# EasyEDA Pro project Git_USB_Hub.epro

# Schematic Schematic1
Board Name: Board1; Create Date: 2026-07-28; Page Name: P1; Project Name: USB_Hub; Schematic Name: Schematic1; Update Date: 2026-07-28; Company: EasyEDA.com; Page Size: A4; Version: V1.0
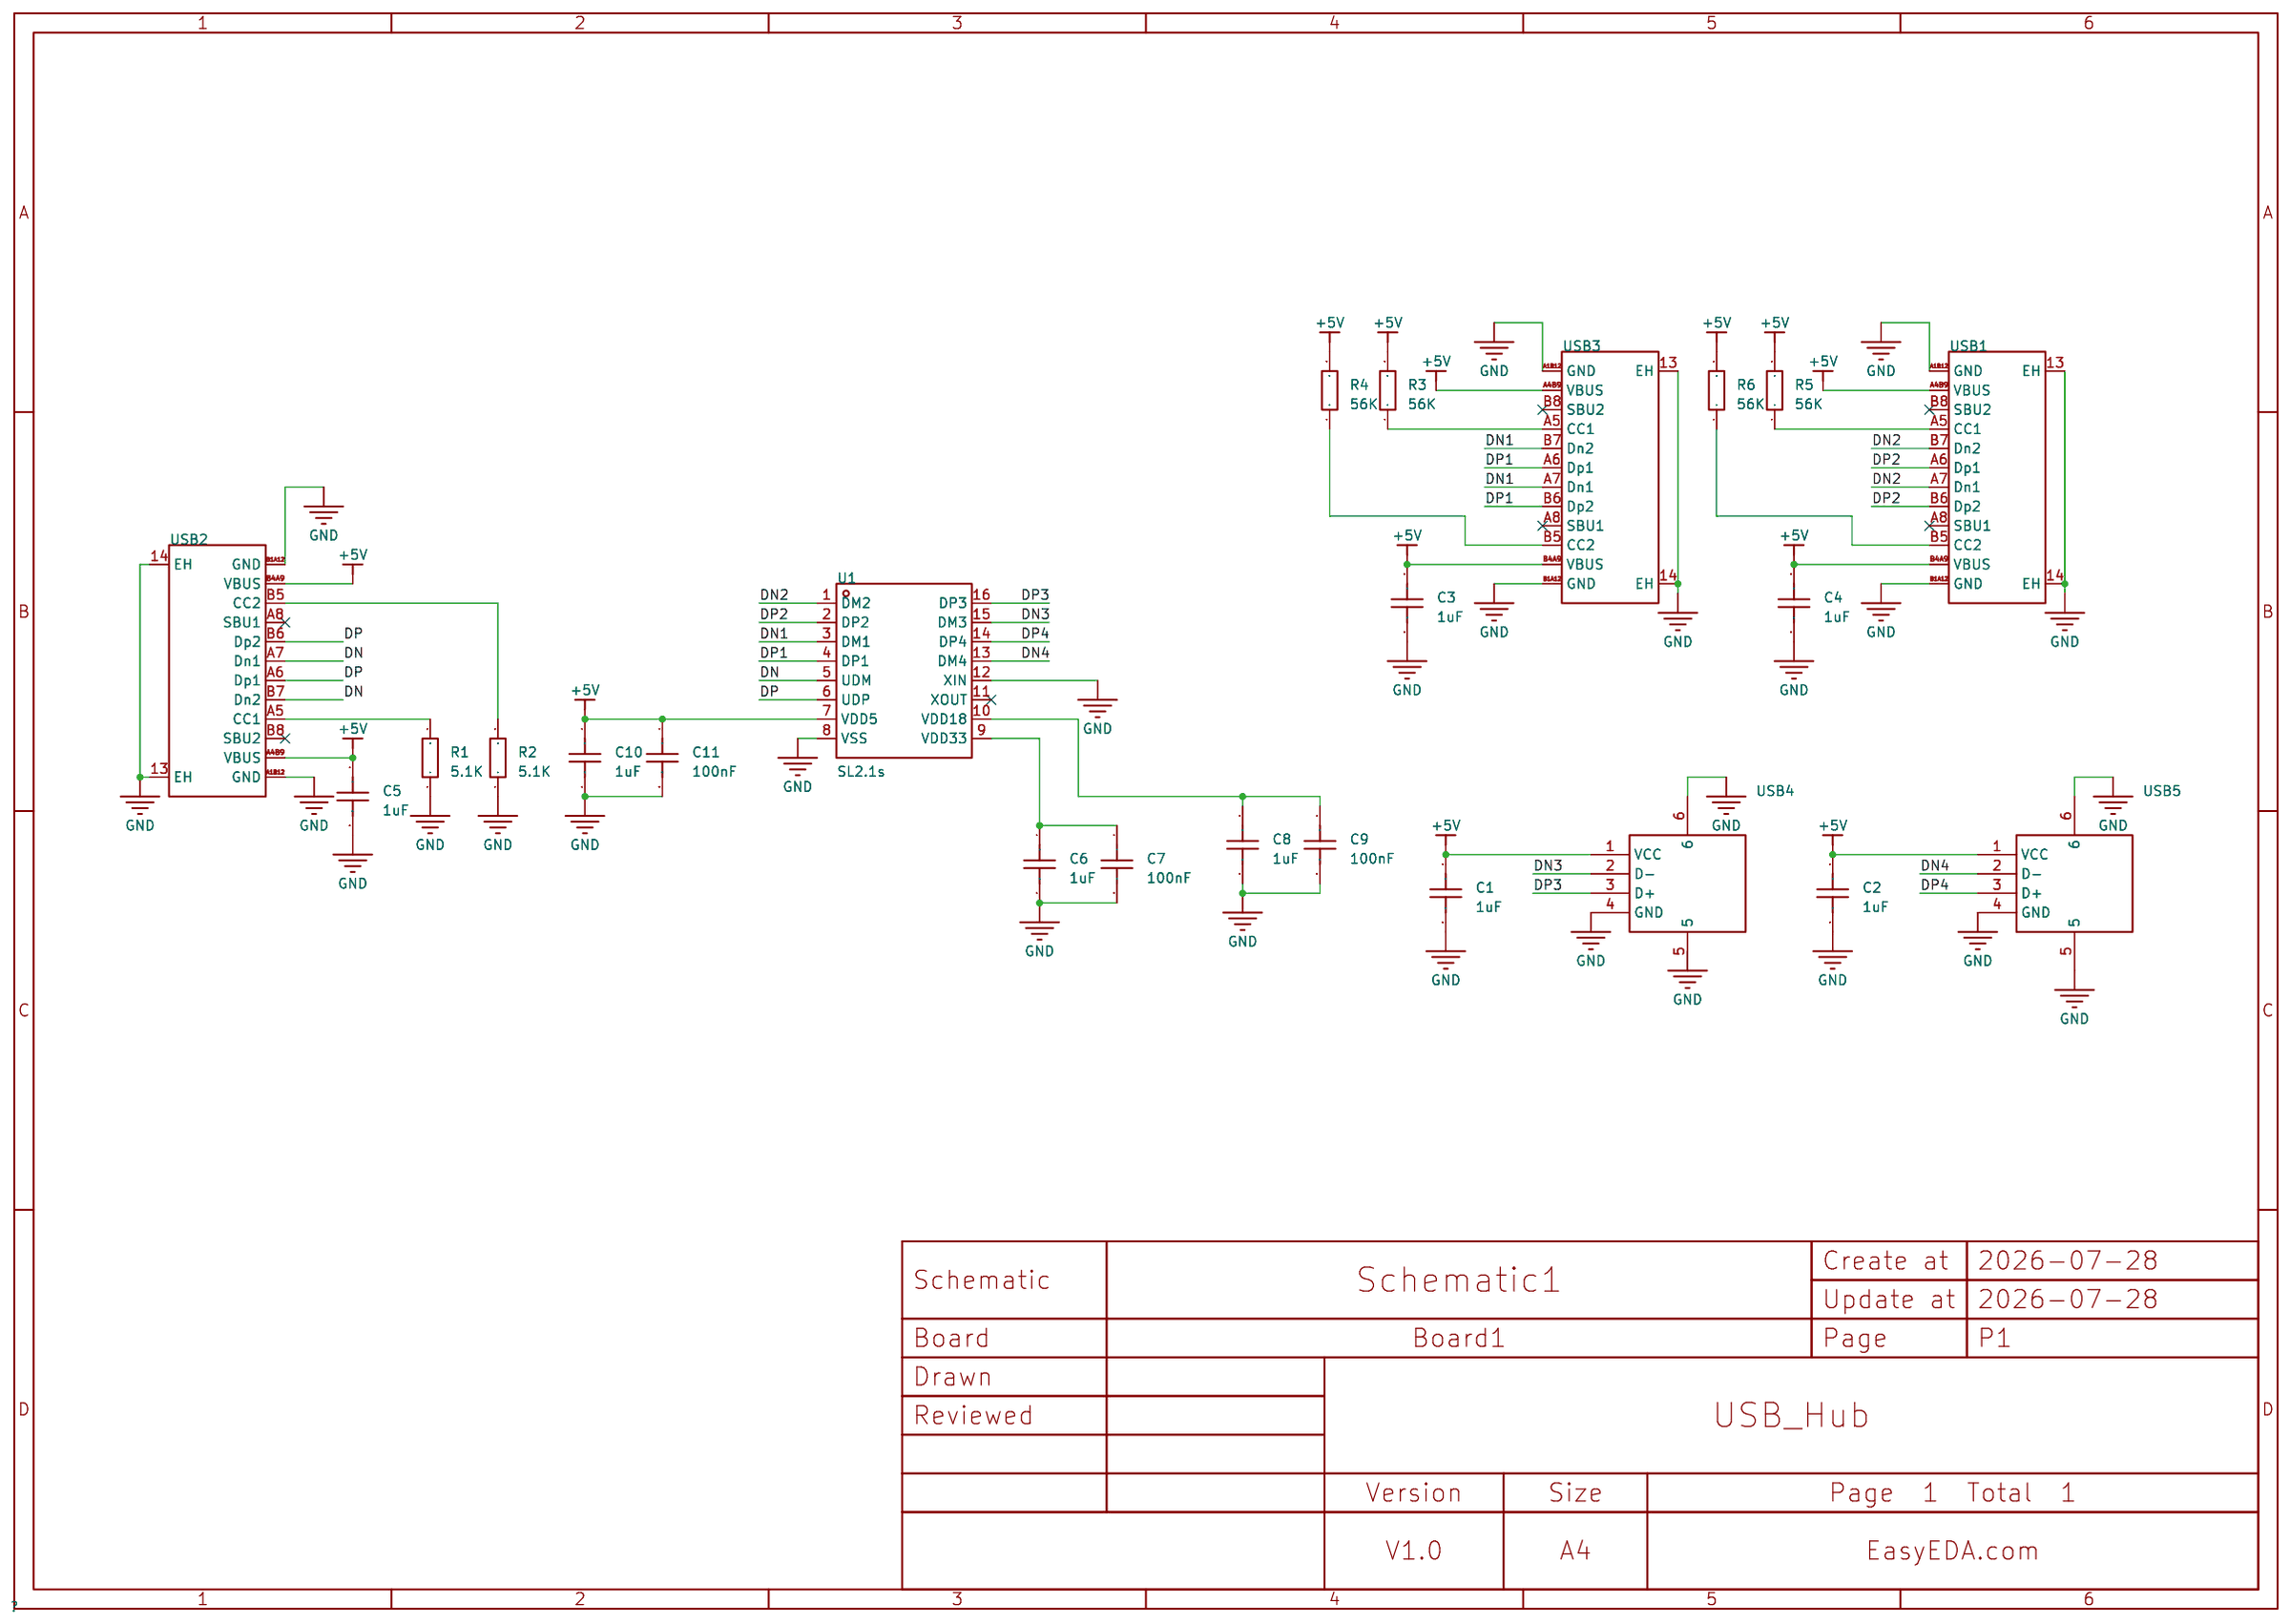
[diagram p0: schematic sheet]

## Parts
C1  1uF  [C0603]
C2  1uF  [C0603]
C3  1uF  [C0603]
C4  1uF  [C0603]
C5  1uF  [C0603]
C6  1uF  [C0603]
C7  100nF  [C0603]
C8  1uF  [C0603]
C9  100nF  [C0603]
C10  1uF  [C0603]
C11  100nF  [C0603]
R1  5.1K  [R0603]
R2  5.1K  [R0603]
R3  56K  [R0603]
R4  56K  [R0603]
R5  56K  [R0603]
R6  56K  [R0603]
U1  SL2.1s  [SSOP-16_L4.6-W2.6-P0.53-LS4.0-BL]
USB1  TYPE-C 16PIN 2MD(073)  [USB-C-SMD_TYPE-C-16PIN-2MD-073]
USB2  TYPE-C 16PIN 2MD(073)  [USB-C-SMD_TYPE-C-16PIN-2MD-073]
USB3  TYPE-C 16PIN 2MD(073)  [USB-C-SMD_TYPE-C-16PIN-2MD-073]
USB4  10.0 QHHTZB6.3  [USB-A-TH_10.0QHHTZB6.3]
USB5  10.0 QHHTZB6.3  [USB-A-TH_10.0QHHTZB6.3]

## Library data of the parts
C1-C11 = CAP_0603: Supplier Footprint: 0603
R1-R6 = Res_0603: Supplier Footprint: 0603
U1 = SL2.1s: type:Hub USB Protocol:USB 2.0 Data Rate:- Voltage - Supply:4V~5.25V Voltage - Supply:4V~5.25V Operating Temperature:0℃~+70℃ Operating Temperature:0℃~+70℃ Memory Interface:- Current - Supply:120mA Quiescent Supply Current:2.5mA Number of Channels:4; LCSC Part Name: USB2.0 HUB控制器集成电路; Supplier Part: C2684433; Manufacturer: CoreChips(和芯润德); Supplier Footprint: SSOP-16; JLCPCB Part Class: Extended Part; Datasheet: https://item.szlcsc.com/datasheet/SL2.1s/2782346.html; Supplier: LCSC; type: Hub; USB Protocol: USB 2.0; Voltage - Supply: 4V~5.25V; Operating Temperature: 0℃~+70℃; Current - Supply: 120mA; Quiescent Supply Current: 2.5mA; Number of Channels: 4
USB1-USB3 = TYPE-C 16PIN 2MD(073): Connector Type:Type-C Protocol Standard:- Gender:Female Mounting Type:Surface Mount, Right Angle Number of Contacts:16P Number of Ports:1 Current Rating-Power:3A Voltage Rating:5V Connect-Disconnect Life:10,000 cycles Supplementary Features:- Center Heigh; LCSC Part Name: Type-C 母 卧贴; Supplier Part: C2765186; Manufacturer: SHOU HAN(首韩); Supplier Footprint: SMD; JLCPCB Part Class: Extended Part; Datasheet: https://item.szlcsc.com/datasheet/TYPE-C%252016PIN%25202MD(073)/2901843.html; Supplier: LCSC; Connector Type: Type-C; Gender: Female; Mounting Type: Surface Mount, Right Angle; Number of Contacts: 16P; Number of Ports: 1; Current Rating-Power: 3A; Voltage Rating: 5V; Connect-Disconnect Life: 10,000 cycles; Detection color: Black; Operating Temperature: -25℃~+85℃
USB4 USB5 = 10.0 QHHTZB6.3: Connector Type:Type-A Protocol Standard:USB 2.0 Gender:Female Mounting Type:Surface Mount, Right Angle Number of Contacts:4P Number of Ports:1 Current Rating-Power:1.5A Voltage Rating:30V Connect-Disconnect Life:5,000 times Supplementary Features:- Center; LCSC Part Name: 壳长10.0mm; Supplier Part: C668591; Manufacturer: SHOU HAN(首韩); Supplier Footprint: SMD; JLCPCB Part Class: Extended Part; Datasheet: https://item.szlcsc.com/datasheet/10.0%2520QHHTZB6.3/698534.html; Supplier: LCSC; Connector Type: Type-A; Protocol Standard: USB 2.0; Gender: Female; Mounting Type: Surface Mount, Right Angle; Number of Contacts: 4P; Number of Ports: 1; Current Rating-Power: 1.5A; Voltage Rating: 30V; Connect-Disconnect Life: 5,000 times; Length: 10mm; Detection color: Black; Operating Temperature: -25℃~+85℃

## Nets
+5V: C1.1 C2.1 C3.1 C4.1 C5.1 C10.1 C11.1 R3.2 R4.2 R5.2 R6.2 U1.7(VDD5) USB1.A4B9(VBUS) USB1.B4A9(VBUS) USB2.A4B9(VBUS) USB2.B4A9(VBUS) USB3.A4B9(VBUS) USB3.B4A9(VBUS) USB4.1(VCC) USB5.1(VCC)
GND: C1.2 C2.2 C3.2 C4.2 C5.2 C6.2 C7.2 C8.2 C9.2 C10.2 C11.2 R1.1 R2.1 U1.8(VSS) U1.12(XIN) USB1.13(EH) USB1.14(EH) USB1.A1B12(GND) USB1.B1A12(GND) USB2.13(EH) USB2.14(EH) USB2.A1B12(GND) USB2.B1A12(GND) USB3.13(EH) USB3.14(EH) USB3.A1B12(GND) USB3.B1A12(GND) USB4.4(GND) USB4.5 USB4.6 USB5.4(GND) USB5.5 USB5.6
DN: U1.5(UDM) USB2.A7(Dn1) USB2.B7(Dn2)
DN1: U1.3(DM1) USB3.A7(Dn1) USB3.B7(Dn2)
DN2: U1.1(DM2) USB1.A7(Dn1) USB1.B7(Dn2)
DN3: U1.15(DM3) USB4.2(D-)
DN4: U1.13(DM4) USB5.2(D-)
DP: U1.6(UDP) USB2.A6(Dp1) USB2.B6(Dp2)
DP1: U1.4(DP1) USB3.A6(Dp1) USB3.B6(Dp2)
DP2: U1.2(DP2) USB1.A6(Dp1) USB1.B6(Dp2)
DP3: U1.16(DP3) USB4.3(D+)
DP4: U1.14(DP4) USB5.3(D+)
$1N7: R2.2 USB2.B5(CC2)
$1N8: R1.2 USB2.A5(CC1)
$1N60: R4.1 USB3.B5(CC2)
$1N61: R3.1 USB3.A5(CC1)
$1N62: R5.1 USB1.A5(CC1)
$1N63: R6.1 USB1.B5(CC2)
$1N81: C6.1 C7.1 U1.9(VDD33)
$1N82: C8.1 C9.1 U1.10(VDD18)

Not connected (* = marked no-connect by the designer): U1 11(XOUT)*; USB1 A8(SBU1)* B8(SBU2)*; USB2 A8(SBU1)* B8(SBU2)*; USB3 A8(SBU1)* B8(SBU2)*

# Board PCB1
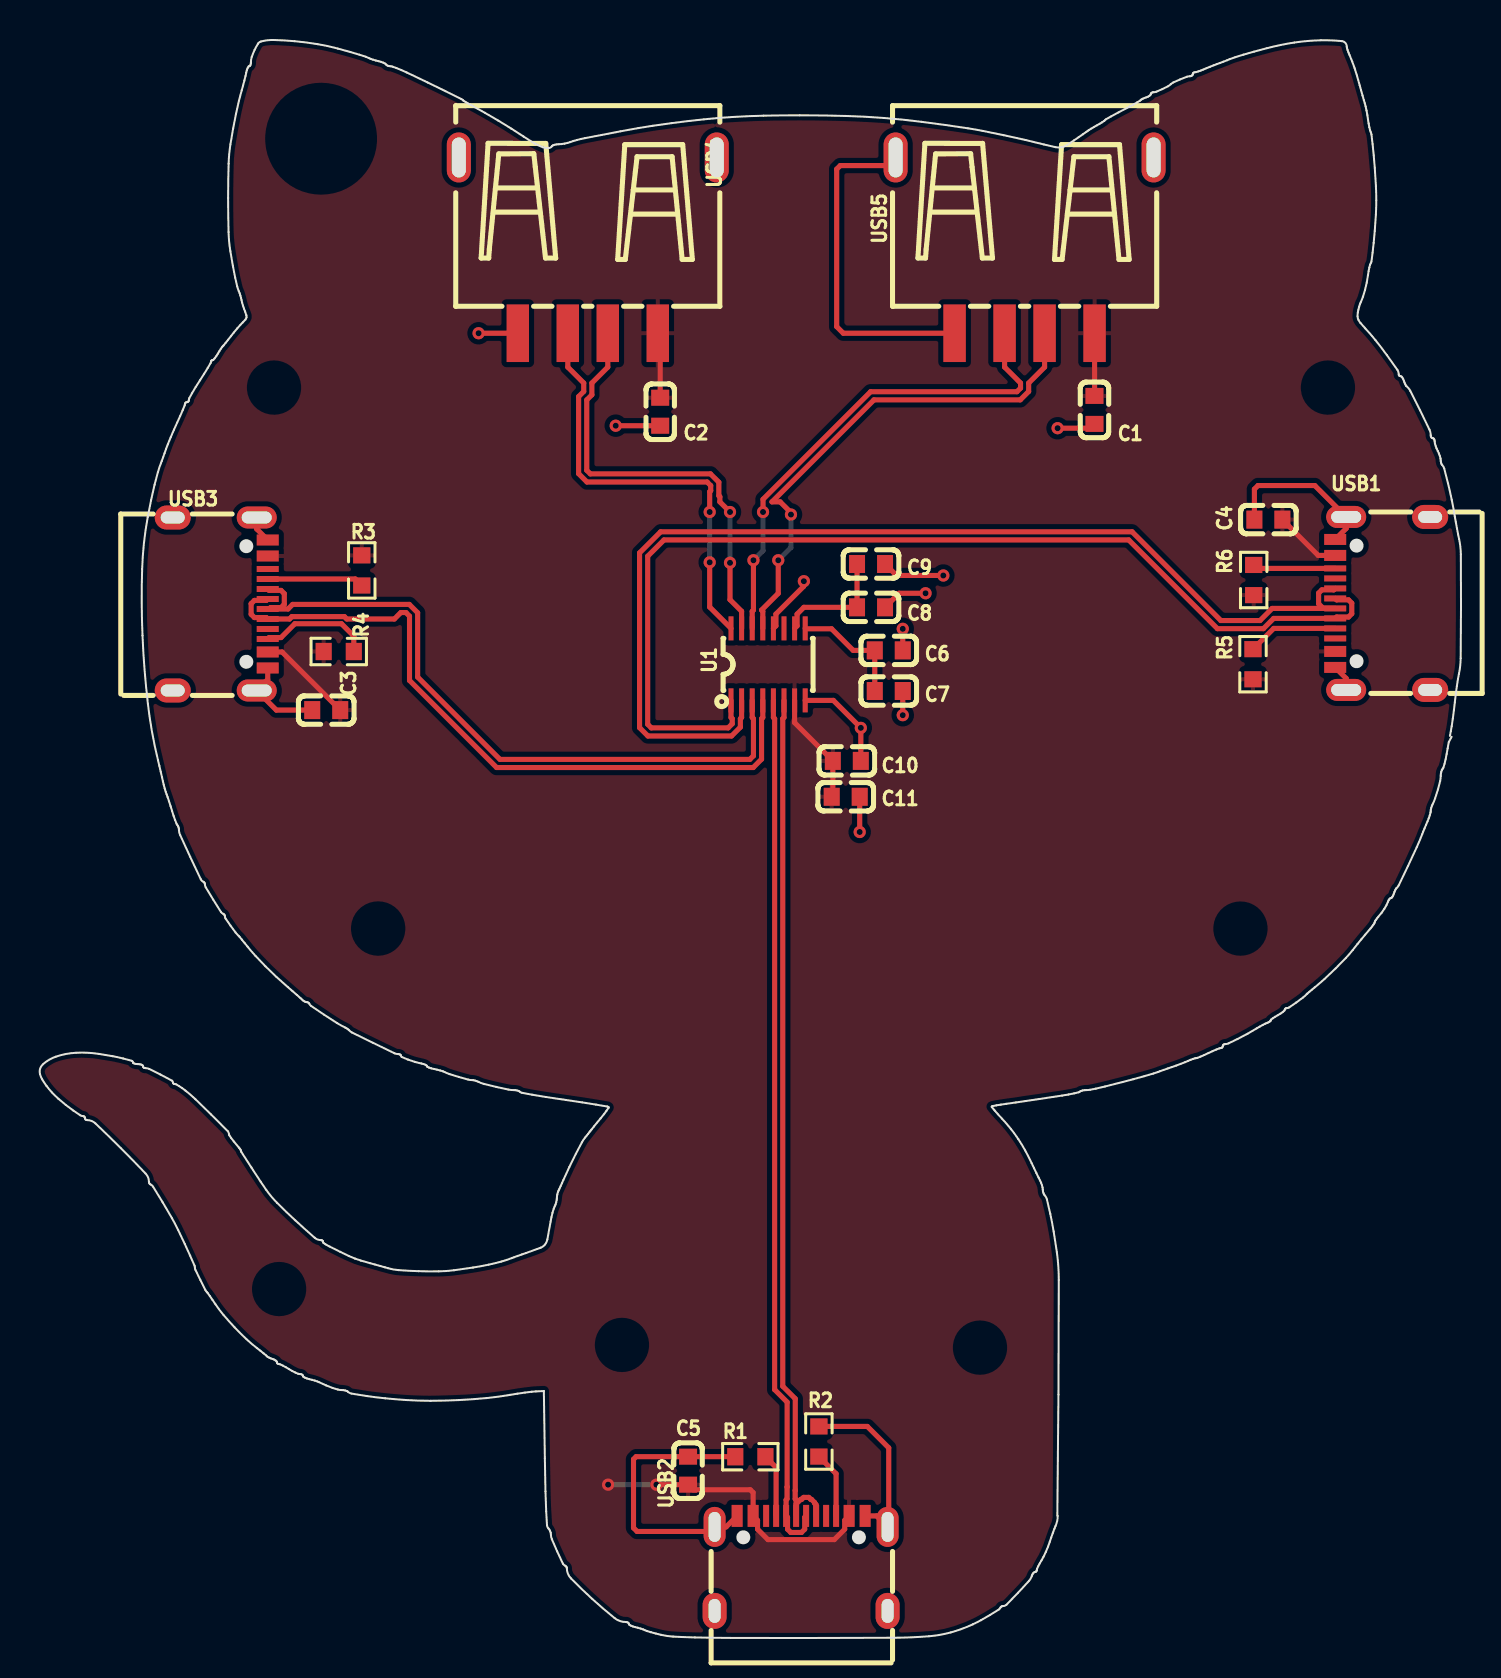
[diagram p1: board, top side]
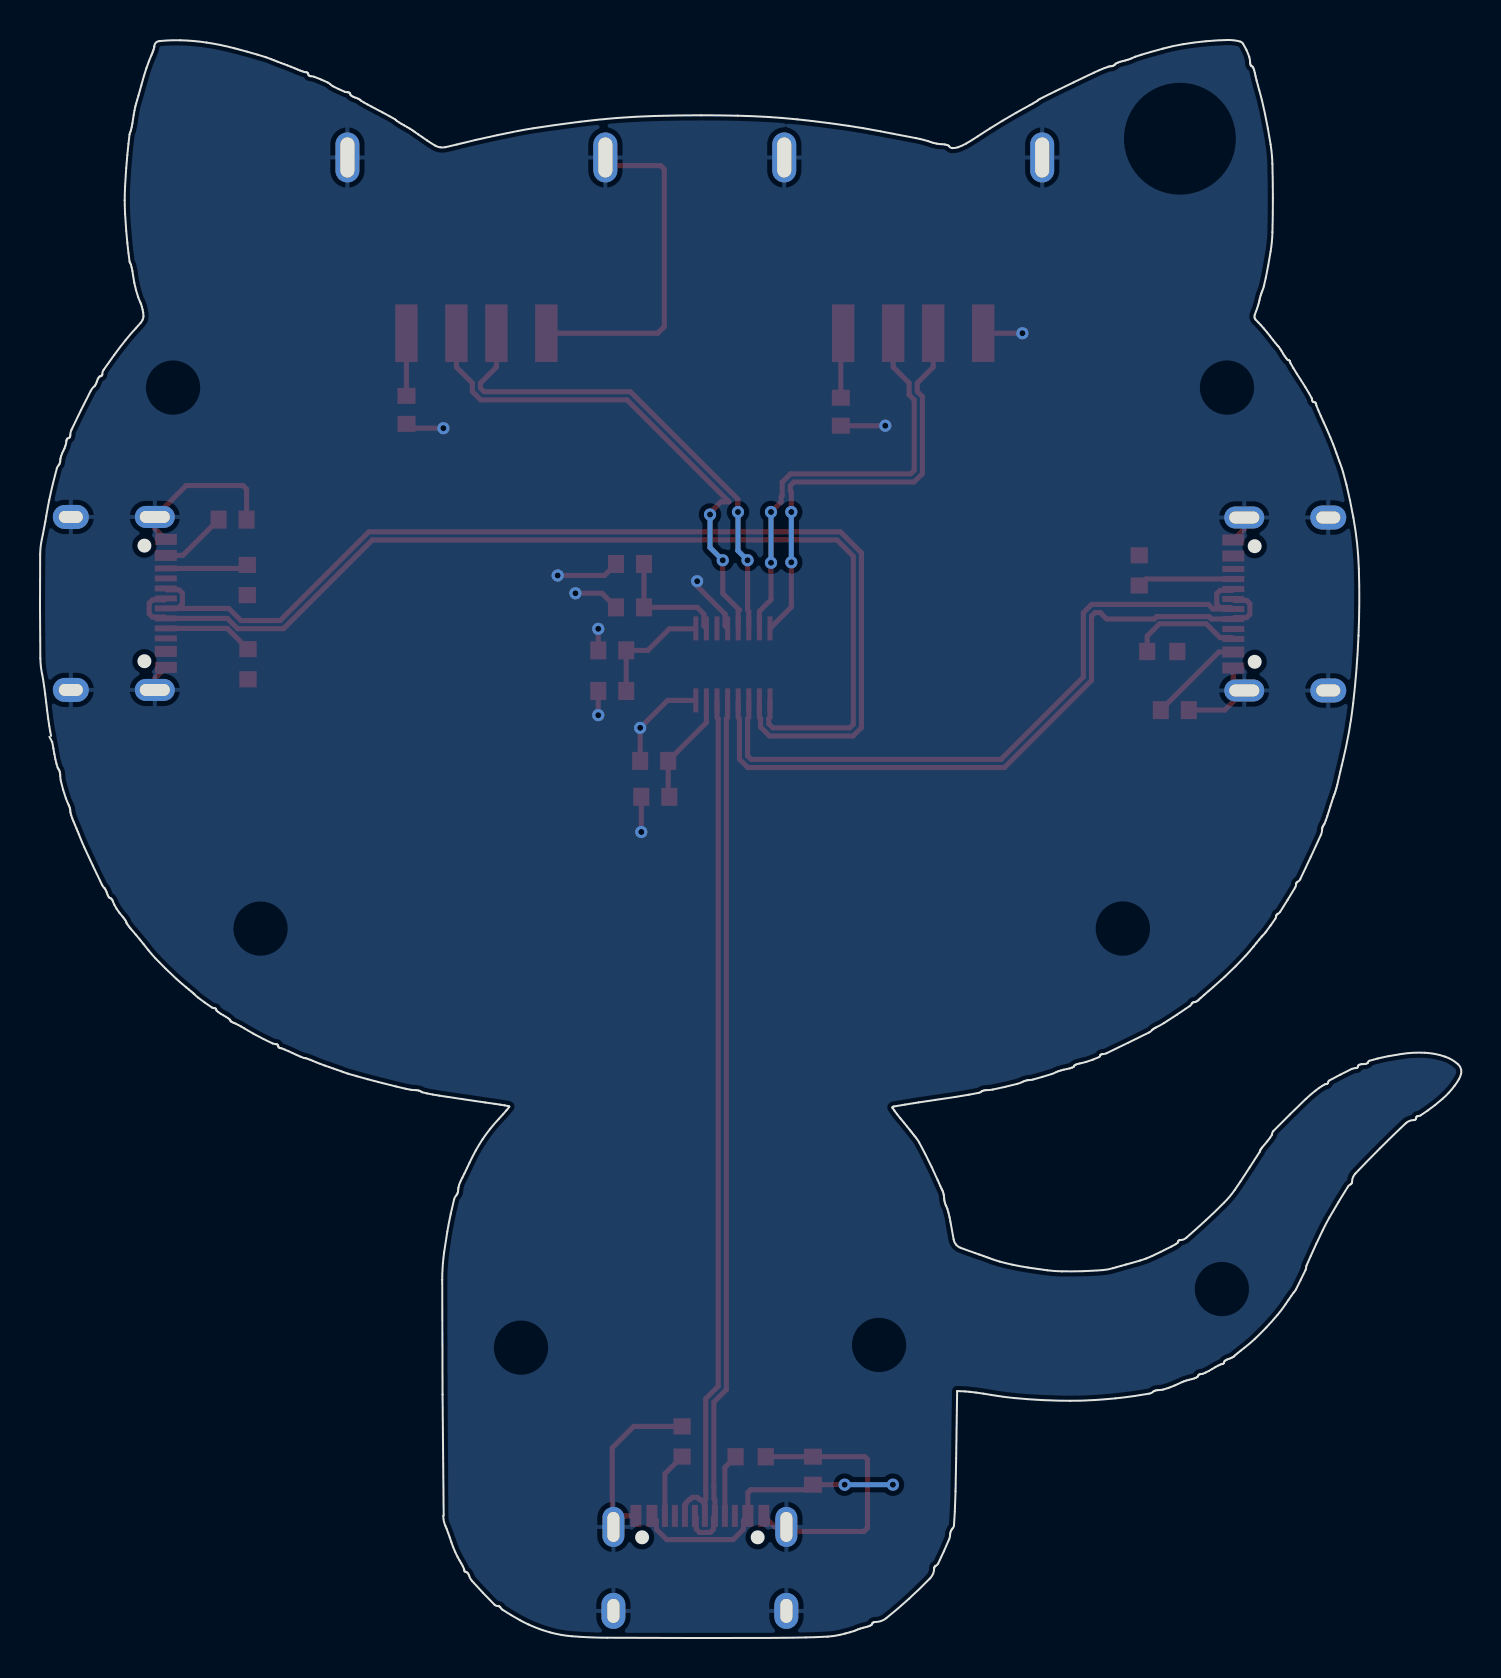
[diagram p2: board, bottom side, seen from below]

Outline 71.08 x 79.91 mm; copper layers: Top Layer, Bottom Layer. Coordinates in mm from the lower left corner of the outline.
Stack: Top Layer 0.035mm / Dielectric1 1.51mm FR4 er 4.5 / Bottom Layer 0.035mm

## Design rules (mm)
net DN2: DP3
net DP2: DP3
net DN1: DP2
net DP1: DP2
net DN: DP1
net DP: DP1
net DN4: DP5
net DP4: DP5
net DN3: DP4
net DP3: DP4
spacing copperThickness1oz (default): track to track 0.102, other pairs 0.152 to 0.3
spacing copperThickness2oz: track to track 0.203, other pairs 0.152 to 0.3
track width copperThickness1oz (default): min 0.127, default 0.254, max 2.54
track width copperThickness2oz: min 0.203, default 0.254, max 2.54
differential pair differentialPair (default): width min 0.127, default 0.254, max 2.54; gap min 0.152, default 0.152
net +5V uses copperRegion
net GND uses copperRegion

## Placement (name value [footprint] x y rotation side)
C1  1uF  [C0603]  52.75 61.42 270 top
C2  1uF  [C0603]  31.03 61.32 270 top
C3  1uF  [C0603]  14.33 46.4 180 top
C4  1uF  [C0603]  61.45 55.93 180 top
C5  1uF  [C0603]  32.42 8.37 90 top
C6  1uF  [C0603]  42.46 49.39 0 top
C7  100nF  [C0603]  42.46 47.36 0 top
C8  1uF  [C0603]  41.57 51.54 0 top
C9  100nF  [C0603]  41.57 53.71 0 top
C10  1uF  [C0603]  40.36 43.86 0 top
C11  100nF  [C0603]  40.31 42.07 0 top
R1  5.1K  [R0603]  35.54 9.07 0 top
R2  5.1K  [R0603]  38.97 9.83 270 top
R3  56K  [R0603]  16.11 53.39 90 top
R4  56K  [R0603]  14.95 49.33 180 top
R5  56K  [R0603]  60.67 48.7 270 top
R6  56K  [R0603]  60.71 52.91 270 top
U1  SL2.1s  [SSOP-16_L4.6-W2.6-P0.53-LS4.0-BL]  36.43 48.69 0 top
USB1  TYPE-C 16PIN 2MD(073)  [USB-C-SMD_TYPE-C-16PIN-2MD-073]  67.16 51.74 90 top
USB2  TYPE-C 16PIN 2MD(073)  [USB-C-SMD_TYPE-C-16PIN-2MD-073]  38.08 3.73 0 top
USB3  TYPE-C 16PIN 2MD(073)  [USB-C-SMD_TYPE-C-16PIN-2MD-073]  9.03 51.71 270 top
USB4  10.0 QHHTZB6.3  [USB-A-TH_10.0QHHTZB6.3]  27.41 69.64 180 top
USB5  10.0 QHHTZB6.3  [USB-A-TH_10.0QHHTZB6.3]  49.25 69.64 180 top

## Footprints (pads in the part's own frame, mm; a bottom-side part is the same pattern mirrored in y, then rotated)
C0603
  rect 0.8x0.9 smd: 1(-0.7,0) 2(0.7,0)
R0603
  rect 0.806x0.864 smd: 1(-0.753,0) 2(0.753,0)
SSOP-16_L4.6-W2.6-P0.53-LS4.0-BL
  rect 0.25x1.2 smd: 1(-1.855,-1.8) 2(-1.325,-1.8) 3(-0.795,-1.8) 4(-0.265,-1.8) 5(0.265,-1.8) 6(0.795,-1.8) 7(1.325,-1.8) 8(1.855,-1.8) 9(1.855,1.8) 10(1.325,1.8) 11(0.795,1.8) 12(0.265,1.8) 13(-0.265,1.8) 14(-0.795,1.8) 15(-1.325,1.8) 16(-1.855,1.8)
USB-A-TH_10.0QHHTZB6.3
  rect 1.12x2.88 smd: 1(-3.5,4.395) 2(-1,4.395) 3(1,4.395) 4(3.5,4.395)
  oval 1.2x2.5 hole 0.7x2: 5(-6.45,-4.395) 6(6.45,-4.395)
USB-C-SMD_TYPE-C-16PIN-2MD-073
  oval 1.1x2 hole 0.6x1.5: 13(-4.325,1.825) 14(4.325,1.825)
  oval 1.2x1.8 hole 0.6x1.2: 13(-4.325,-2.375) 14(4.325,-2.375)
  rect 0.55x1.1 smd: A1B12(-3.2,2.375) A4B9(-2.4,2.375) B1A12(3.2,2.375) B4A9(2.4,2.375)
  rect 0.3x1.1 smd: A5(-1.25,2.375) A6(-0.25,2.375) A7(0.25,2.375) A8(1.25,2.375) B5(1.75,2.375) B6(0.75,2.375) B7(-0.75,2.375) B8(-1.75,2.375)

## Nets
As in the schematic.

Pads without a net: U1 11; USB1 A8 B8; USB2 A8 B8; USB3 A8 B8

## Via types
v1: diameter 0.61, hole 0.305, Top Layer to Bottom Layer, 20 vias

## Routing (per net, layer and track width the routed paths; a pad name or vN(x,y) marks a point on that pad's centre or on a via; arc(x,y) is an arc through that point)
+5V: length 35.1
  Top Layer w0.254: C1.1 52.75,62.12 USB5.1 ; USB4.1 31.03,65.13 C2.1 ; C4.1 63.94,54.14 USB1.B4A9 ; U1.7 37.75,45.77 C10.1 39.66,42.12 C11.1 ; C3.1 12.12,49.31 USB3.B4A9 ; USB2.B4A9 40.26,5.88 40.26,5.44 39.74,4.92 36.42,4.92 35.9,5.44 35.9,5.88 USB2.A4B9 35.68,7.27 35.54,7.41 32.68,7.41 C5.1 v1(30.84,7.67)
  Bottom Layer w0.254: v1(30.84,7.67) v1(28.43,7.67)
GND: length 79.6
  Top Layer w0.254: USB1.A1B12 65.34,47.99 65.34,47.41 ; C4.2 60.75,57.45 60.93,57.63 63.77,57.63 USB1.14 65.34,55.49 USB1.B1A12 ; v1(45.19,53.13) 42.85,53.13 C9.2 ; R1.1 34.78,9.07 C5.2 29.83,9.07 29.7,8.94 29.7,5.51 29.88,5.33 33.53,5.33 USB2.13 34.33,5.56 USB2.A1B12 ; 13.63,46.4 11.84,46.4 USB3.14 11.4,47.93 USB3.B1A12 ; v1(50.91,60.5) 52.53,60.5 C1.2 ; 43.16,47.36 v1(43.16,46.15) ; v1(44.3,52.25) 42.98,52.25 C8.2 ; USB5.4 40.19,65.25 39.86,65.58 39.86,73.45 40.04,73.63 42.4,73.63 USB5.6 ; C11.2 v1(41.01,40.31) ; 10.85,56.03 10.85,55.46 USB3.A1B12 ; USB4.4 v1(21.95,65.25) ; 38.21,52.88 38.21,52.59 36.82,51.2 36.82,50.62 U1.12 ; 43.16,49.39 v1(43.16,50.47) ; R2.1 41.39,10.58 42.46,9.51 42.46,5.61 USB2.14 41.85,6.11 USB2.B1A12 ; C2.2 v1(28.81,60.62) ; C10.2 v1(41.06,45.51) 39.69,46.89 U1.8
  vias: v1(38.21,52.85)
DN: length 43.5
  Top Layer w0.254: U1.5 36.69,46.04 36.75,45.97 36.75,12.42 37.38,11.8 37.38,7.55 37.37,7.55 37.37,6.96 37.33,6.91 USB2.B7 37.4,6.04 37.4,5.44 37.56,5.28 38.09,5.28 38.26,5.44 38.26,6.04 USB2.A7
DN1: length 34.7
  Top Layer w0.254: USB3.B7 11.47,52.39 12.07,52.39 12.23,52.22 12.23,51.69 12.07,51.53 11.55,51.53 11.5,51.48 11.43,51.48 USB3.A7 12.42,51.46 12.65,51.69 18.48,51.69 18.9,51.27 18.9,48.05 23.02,43.94 35.51,43.94 35.69,44.12 35.69,45.97 35.63,46.04 U1.3
DN2: length 53.1
  Top Layer w0.254: USB1.A7 64.86,51.92 65.45,51.92 65.61,51.75 65.61,51.22 65.45,51.06 64.86,51.06 USB1.B7 61.71,50.99 61.2,50.48 58.9,50.48 54.46,54.91 31.22,54.91 30.4,54.1 30.4,45.69 30.58,45.51 34.43,45.51 34.63,45.72 34.63,45.97 34.57,46.04 U1.1
DN3: length 21.9
  Top Layer w0.254: USB4.2 28.41,63.56 27.61,62.76 27.61,62.17 27.36,61.91 27.36,58.4 27.54,58.22 33.55,58.22 33.96,57.8 33.96,57.12 34.01,57.07 34.01,56.82 v1(34.52,56.31) ; v1(34.52,53.77) 34.52,51.92 35.1,51.34 U1.15
  Bottom Layer w0.254: v1(34.52,53.77) v1(34.52,56.31)
DN4: length 26
  Top Layer w0.254: U1.13 36.16,51.34 36.1,51.41 36.93,52.24 v1(36.93,53.9) ; USB5.2 50.25,63.56 49.46,62.76 49.46,62.34 49.04,61.92 41.72,61.92 36.62,56.82 37.03,56.82 37.57,56.28 v1(37.57,56.18)
  Bottom Layer w0.254: v1(36.93,53.9) 37.57,54.53 v1(37.57,56.18)
DP: length 43
  Top Layer w0.254: U1.6 37.22,46.03 37.16,45.97 37.16,12.59 37.79,11.96 37.79,7.38 37.78,7.38 37.78,6.96 37.83,6.91 37.83,6.7 ; 37.83,6.7 38.06,6.94 38.11,6.94 38.21,7.03 38.46,7.03 38.56,6.94 38.59,6.94 38.76,6.77 38.76,6.74 38.83,6.66 USB2.B6 ; 37.83,6.7 USB2.A6
DP1: length 35.5
  Top Layer w0.254: U1.4 36.16,46.04 36.1,45.97 36.1,43.95 35.68,43.53 22.85,43.53 18.49,47.89 18.49,51.1 18.31,51.28 18.06,51.28 17.74,50.96 15.36,50.96 15.24,51.08 12.61,51.08 12.49,50.96 USB3.B6 11.33,51.03 10.74,51.03 10.57,51.19 10.57,51.72 10.74,51.89 11.33,51.89 USB3.A6
DP2: length 54.6
  Top Layer w0.254: 64.15,51.49 USB1.A6 ; 64.15,51.49 64.15,51.53 63.96,51.72 63.96,52.25 64.12,52.42 64.72,52.42 USB1.B6 ; 64.15,51.49 61.63,51.49 61.03,50.88 59.07,50.88 54.63,55.32 31.05,55.32 30,54.27 30,45.53 30.42,45.11 34.6,45.11 35.04,45.55 35.04,45.97 35.1,46.03 U1.2
DP3: length 21.9
  Top Layer w0.254: USB4.3 26.41,63.56 27.21,62.76 27.21,62.34 26.95,62.08 26.95,58.23 27.37,57.81 33.38,57.81 33.56,57.63 33.56,57.38 33.51,57.32 v1(33.51,56.31) ; v1(33.51,53.79) 33.51,51.56 U1.16
  Bottom Layer w0.254: v1(33.51,53.79) v1(33.51,56.31)
DP4: length 24.9
  Top Layer w0.254: v1(35.69,53.9) 35.69,51.4 35.63,51.34 U1.14 ; v1(36.17,56.31) 36.17,56.94 41.55,62.32 48.87,62.32 49.05,62.5 49.05,62.76 48.25,63.56 USB5.3
  Bottom Layer w0.254: v1(35.69,53.9) 36.17,54.38 v1(36.17,56.31)
$1N7: length 3.3
  Top Layer w0.254: R2.2 39.83,8.21 USB2.B5
$1N8: length 3.2
  Top Layer w0.254: USB2.A5 36.83,8.53 R1.2
$1N60: length 5.6
  Top Layer w0.254: USB3.B5 11.48,50.03 12.07,50.03 12.76,50.72 15.09,50.72 15.71,50.1 15.71,49.33
$1N61: length 4.8
  Top Layer w0.254: USB3.A5 15.78,52.96 R3.1
$1N62: length 4.5
  Top Layer w0.254: R5.1 61.71,50.49 USB1.A5
$1N63: length 4.1
  Top Layer w0.254: 60.71,53.66 60.88,53.49 USB1.B5
$1N81: length 6
  Top Layer w0.254: C7.1 C6.1 40.68,49.39 39.6,50.47 38.3,50.47 U1.9
$1N82: length 6.1
  Top Layer w0.254: U1.10 37.88,50.62 37.88,51.2 38.21,51.54 C8.1 C9.1

## Copper pours and planes (outline as drawn; the poured copper is in the pictures)
+5V on Top Layer: -3.71,83.87 80.88,83.87 80.88,-4.78 -3.71,-4.78
GND on Bottom Layer: -9.55,85.39 80.75,85.39 80.75,-1.6 -9.55,-1.6
